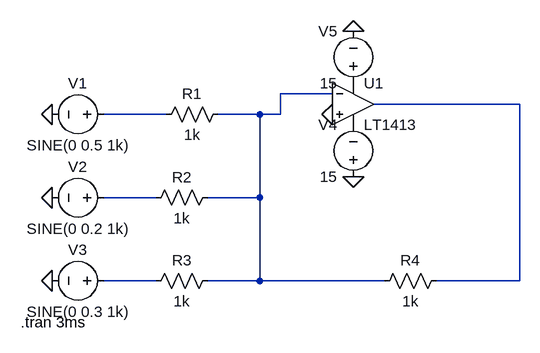
[diagram p0: schematic EXP-6_VoltaegAdder.asc]
EXP-6_VoltaegAdder.asc, the LTspice schematic file:
Version 4
SHEET 1 880 680
WIRE 144 144 64 144
WIRE 432 160 208 160
WIRE -112 176 -208 176
WIRE 32 176 -32 176
WIRE 64 176 64 144
WIRE 64 176 32 176
WIRE -128 304 -208 304
WIRE 32 304 32 176
WIRE 32 304 -48 304
WIRE -128 432 -208 432
WIRE 32 432 32 304
WIRE 32 432 -48 432
WIRE 224 432 32 432
WIRE 432 432 432 160
WIRE 432 432 304 432
FLAG -288 176 0
FLAG -288 304 0
FLAG -288 432 0
FLAG 144 176 0
FLAG 176 272 0
FLAG 176 48 0
SYMBOL voltage -192 176 R90
WINDOW 0 -32 56 VBottom 2
WINDOW 3 32 56 VTop 2
WINDOW 123 0 0 Left 0
WINDOW 39 60 56 VTop 2
SYMATTR InstName V1
SYMATTR Value SINE(0 0.5 1k)
SYMBOL voltage -192 304 R90
WINDOW 0 -32 56 VBottom 2
WINDOW 3 32 56 VTop 2
WINDOW 123 0 0 Left 0
WINDOW 39 0 0 Left 0
SYMATTR InstName V2
SYMATTR Value SINE(0 0.2 1k)
SYMBOL voltage -192 432 R90
WINDOW 0 -32 56 VBottom 2
WINDOW 3 32 56 VTop 2
WINDOW 123 0 0 Left 0
WINDOW 39 0 0 Left 0
SYMATTR InstName V3
SYMATTR Value SINE(0 0.3 1k)
SYMBOL res -16 160 R90
WINDOW 0 0 56 VBottom 2
WINDOW 3 32 56 VTop 2
SYMATTR InstName R1
SYMATTR Value 1k
SYMBOL res -32 288 R90
WINDOW 0 0 56 VBottom 2
WINDOW 3 32 56 VTop 2
SYMATTR InstName R2
SYMATTR Value 1k
SYMBOL res -32 416 R90
WINDOW 0 0 56 VBottom 2
WINDOW 3 32 56 VTop 2
SYMATTR InstName R3
SYMATTR Value 1k
SYMBOL res 320 416 R90
WINDOW 0 0 56 VBottom 2
WINDOW 3 32 56 VTop 2
SYMATTR InstName R4
SYMATTR Value 1k
SYMBOL OpAmps\\LT1413 176 96 R0
SYMATTR InstName U1
SYMBOL voltage 176 288 R180
WINDOW 0 24 96 Left 2
WINDOW 3 24 16 Left 2
WINDOW 123 0 0 Left 0
WINDOW 39 0 0 Left 0
SYMATTR InstName V4
SYMATTR Value 15
SYMBOL voltage 176 144 R180
WINDOW 0 24 96 Left 2
WINDOW 3 24 16 Left 2
WINDOW 123 0 0 Left 0
WINDOW 39 0 0 Left 0
SYMATTR InstName V5
SYMATTR Value 15
TEXT -336 496 Left 2 !.tran 3ms

The netlist it stands for:
* EXP-6_VoltaegAdder.asc
V1 N003 0 SINE(0 0.5 1k)
V2 N004 0 SINE(0 0.2 1k)
V3 N005 0 SINE(0 0.3 1k)
R1 N001 N003 1k
R2 N001 N004 1k
R3 N001 N005 1k
R4 N002 N001 1k
XU1 0 N001 P001 P002 N002 LT1413  ; pins In+ In- V+ V- OUT
V4 0 P002 15
V5 P001 0 15
.tran 3ms
.lib LTC.lib
.backanno
.end